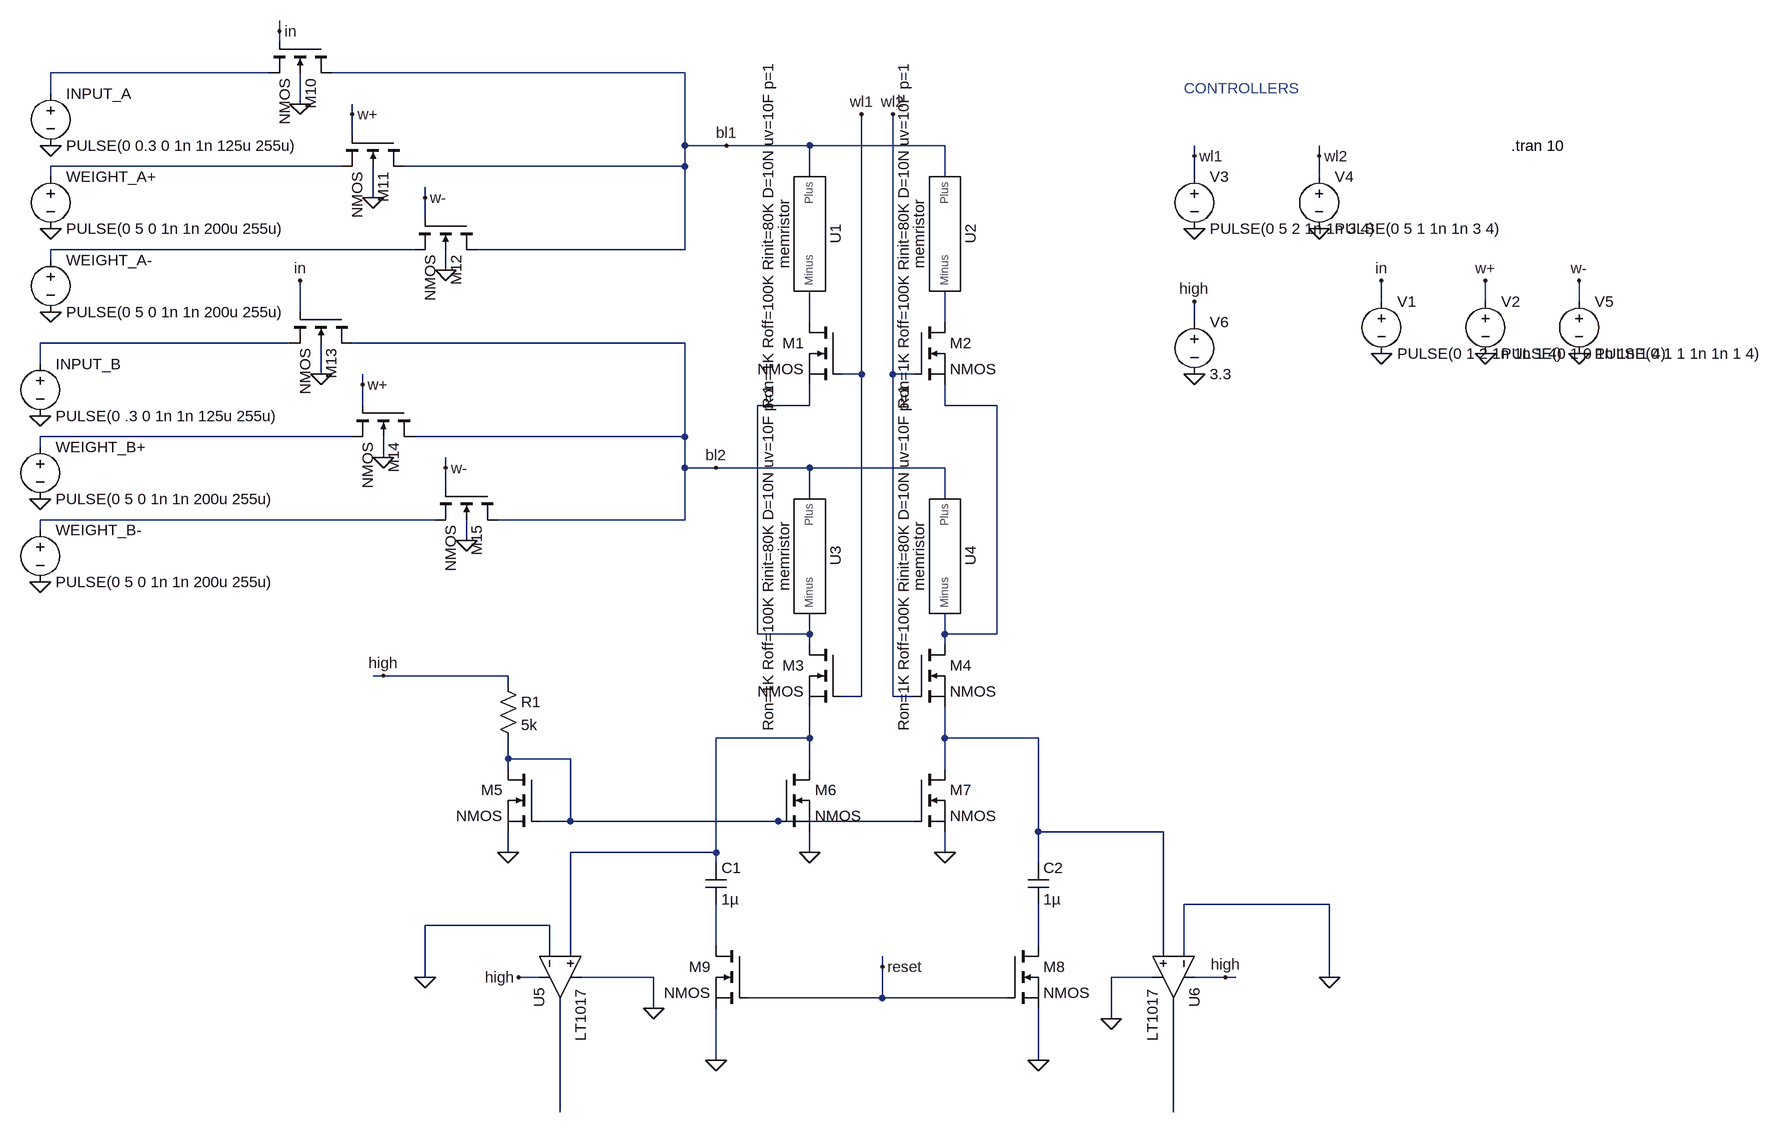
[diagram p0: schematic test_mem.asc]
test_mem.asc, the LTspice schematic file:
Version 4
SHEET 1 1712 1668
WIRE -576 0 -576 -16
WIRE -576 16 -576 0
WIRE -592 64 -928 64
WIRE 48 64 -496 64
WIRE -928 96 -928 64
WIRE -544 112 -544 64
WIRE -464 128 -464 112
WIRE -464 160 -464 128
WIRE 48 176 48 64
WIRE 112 176 48 176
WIRE 240 176 112 176
WIRE 448 176 240 176
WIRE 832 192 832 176
WIRE 1024 192 1024 176
WIRE -480 208 -928 208
WIRE 48 208 48 176
WIRE 48 208 -384 208
WIRE -928 224 -928 208
WIRE 240 224 240 176
WIRE 448 224 448 176
WIRE 832 224 832 192
WIRE 1024 224 1024 192
WIRE -432 256 -432 208
WIRE -352 256 -352 240
WIRE -352 288 -352 256
WIRE -368 336 -928 336
WIRE 48 336 48 208
WIRE 48 336 -272 336
WIRE -928 352 -928 336
WIRE -320 368 -320 336
WIRE 1120 416 1120 384
WIRE 1280 416 1280 384
WIRE 1424 416 1424 384
WIRE -544 432 -544 384
WIRE 240 448 240 400
WIRE 448 448 448 400
WIRE 832 448 832 416
WIRE -560 480 -944 480
WIRE 48 480 -464 480
WIRE -944 512 -944 480
WIRE -512 528 -512 480
WIRE 320 528 320 128
WIRE 320 528 288 528
WIRE 368 528 368 128
WIRE 400 528 368 528
WIRE -448 544 -448 528
WIRE -448 576 -448 544
WIRE 240 576 240 544
WIRE 240 576 160 576
WIRE 448 576 448 544
WIRE 528 576 448 576
WIRE -464 624 -944 624
WIRE 48 624 48 480
WIRE 48 624 -368 624
WIRE -944 640 -944 624
WIRE -416 656 -416 624
WIRE -320 672 -320 656
WIRE 48 672 48 624
WIRE 96 672 48 672
WIRE 240 672 96 672
WIRE 448 672 240 672
WIRE -320 704 -320 672
WIRE 240 720 240 672
WIRE 448 720 448 672
WIRE -336 752 -944 752
WIRE 48 752 48 672
WIRE 48 752 -240 752
WIRE -944 768 -944 752
WIRE -288 784 -288 752
WIRE 160 928 160 576
WIRE 240 928 240 896
WIRE 240 928 160 928
WIRE 448 928 448 896
WIRE 528 928 528 576
WIRE 528 928 448 928
WIRE 240 944 240 928
WIRE 448 944 448 928
WIRE -416 992 -432 992
WIRE -224 992 -416 992
WIRE -224 1008 -224 992
WIRE 320 1024 320 528
WIRE 320 1024 288 1024
WIRE 368 1024 368 528
WIRE 400 1024 368 1024
WIRE 240 1088 240 1040
WIRE 240 1088 96 1088
WIRE 448 1088 448 1040
WIRE 592 1088 448 1088
WIRE -224 1120 -224 1088
WIRE -128 1120 -224 1120
WIRE -224 1136 -224 1120
WIRE 240 1136 240 1088
WIRE 448 1136 448 1088
WIRE -128 1216 -128 1120
WIRE -128 1216 -176 1216
WIRE 192 1216 -128 1216
WIRE 400 1216 192 1216
WIRE 592 1232 592 1088
WIRE 784 1232 592 1232
WIRE -224 1264 -224 1232
WIRE 96 1264 96 1088
WIRE 96 1264 -128 1264
WIRE 240 1264 240 1232
WIRE 448 1264 448 1232
WIRE 96 1280 96 1264
WIRE 592 1280 592 1232
WIRE 1040 1344 816 1344
WIRE -160 1376 -352 1376
WIRE 96 1408 96 1344
WIRE 592 1408 592 1344
WIRE -160 1424 -160 1376
WIRE -128 1424 -128 1264
WIRE 784 1424 784 1232
WIRE 816 1424 816 1344
WIRE 352 1440 352 1424
WIRE -352 1456 -352 1376
WIRE -176 1456 -208 1456
WIRE 0 1456 -112 1456
WIRE 768 1456 704 1456
WIRE 880 1456 832 1456
WIRE 896 1456 880 1456
WIRE 1040 1456 1040 1344
WIRE 352 1488 352 1440
WIRE 352 1488 144 1488
WIRE 544 1488 352 1488
WIRE 0 1504 0 1456
WIRE 704 1520 704 1456
WIRE 96 1584 96 1504
WIRE 592 1584 592 1504
WIRE -144 1664 -144 1488
WIRE 800 1664 800 1488
FLAG 832 304 0
FLAG -928 176 0
FLAG -944 592 0
FLAG 832 192 wl1
FLAG 1024 304 0
FLAG 1024 192 wl2
FLAG 320 128 wl1
FLAG 368 128 wl2
FLAG 240 1264 0
FLAG -224 1264 0
FLAG 448 1264 0
FLAG 592 1584 0
FLAG 96 1584 0
FLAG 0 1504 0
FLAG 704 1520 0
FLAG 832 528 0
FLAG 832 416 high
FLAG 880 1456 high
FLAG -208 1456 high
FLAG -352 1456 0
FLAG 1040 1456 0
FLAG -416 992 high
FLAG -928 304 0
FLAG -928 432 0
FLAG -944 720 0
FLAG -944 848 0
FLAG 112 176 bl1
FLAG 1120 496 0
FLAG 1280 496 0
FLAG 1424 496 0
FLAG 1120 384 in
FLAG 1424 384 w-
FLAG 1280 384 w+
FLAG -576 0 in
FLAG -544 384 in
FLAG -464 128 w+
FLAG -352 256 w-
FLAG -448 544 w+
FLAG -320 672 w-
FLAG 352 1440 reset
FLAG -544 112 0
FLAG -432 256 0
FLAG -320 368 0
FLAG -512 528 0
FLAG -416 656 0
FLAG -288 784 0
FLAG 96 672 bl2
SYMBOL nmos 288 448 M0
SYMATTR InstName M1
SYMBOL nmos 400 448 R0
SYMATTR InstName M2
SYMBOL nmos 288 944 M0
SYMATTR InstName M3
SYMBOL nmos 400 944 R0
SYMATTR InstName M4
SYMBOL Voltage -928 80 R0
SYMATTR InstName INPUT_A
SYMATTR Value PULSE(0 0.3 0 1n 1n 125u 255u)
SYMBOL Voltage -944 496 R0
SYMATTR InstName INPUT_B
SYMATTR Value PULSE(0 .3 0 1n 1n 125u 255u)
SYMBOL Voltage 832 208 R0
SYMATTR InstName V3
SYMATTR Value PULSE(0 5 2 1n 1n 3 4)
SYMBOL Voltage 1024 208 R0
SYMATTR InstName V4
SYMATTR Value PULSE(0 5 1 1n 1n 3 4)
SYMBOL nmos -176 1136 M0
SYMATTR InstName M5
SYMBOL nmos 192 1136 R0
SYMATTR InstName M6
SYMBOL nmos 400 1136 R0
SYMATTR InstName M7
SYMBOL Res -240 992 R0
SYMATTR InstName R1
SYMATTR Value 5k
SYMBOL Cap 80 1280 R0
SYMATTR InstName C1
SYMATTR Value 1µ
SYMBOL Cap 576 1280 R0
SYMATTR InstName C2
SYMATTR Value 1µ
SYMBOL nmos 544 1408 R0
SYMATTR InstName M8
SYMBOL nmos 144 1408 M0
SYMATTR InstName M9
SYMBOL LT1017 -144 1456 M90
SYMATTR InstName U5
SYMBOL LT1017 800 1456 R90
SYMATTR InstName U6
SYMBOL Voltage 832 432 R0
SYMATTR InstName V6
SYMATTR Value 3.3
SYMBOL AutoGenerated/memristor 240 304 R90
SYMATTR InstName U1
SYMBOL AutoGenerated/memristor 448 304 R90
SYMATTR InstName U2
SYMBOL AutoGenerated/memristor 240 800 R90
SYMATTR InstName U3
SYMBOL AutoGenerated/memristor 448 800 R90
SYMATTR InstName U4
SYMBOL Voltage -928 208 R0
SYMATTR InstName WEIGHT_A+
SYMATTR Value PULSE(0 5 0 1n 1n 200u 255u)
SYMBOL Voltage -928 336 R0
SYMATTR InstName WEIGHT_A-
SYMATTR Value PULSE(0 5 0 1n 1n 200u 255u)
SYMBOL Voltage -944 624 R0
SYMATTR InstName WEIGHT_B+
SYMATTR Value PULSE(0 5 0 1n 1n 200u 255u)
SYMBOL Voltage -944 752 R0
SYMATTR InstName WEIGHT_B-
SYMATTR Value PULSE(0 5 0 1n 1n 200u 255u)
SYMBOL Voltage 1120 400 R0
SYMATTR InstName V1
SYMATTR Value PULSE(0 1 2 1n 1n 1 4)
SYMBOL Voltage 1280 400 R0
SYMATTR InstName V2
SYMATTR Value PULSE(0 1 0 1n 1n 1 4)
SYMBOL Voltage 1424 400 R0
SYMATTR InstName V5
SYMATTR Value PULSE(0 1 1 1n 1n 1 4)
SYMBOL nmos4 -496 16 R90
SYMATTR InstName M10
SYMBOL nmos4 -384 160 R90
SYMATTR InstName M11
SYMBOL nmos4 -272 288 R90
SYMATTR InstName M12
SYMBOL nmos4 -464 432 R90
SYMATTR InstName M13
SYMBOL nmos4 -368 576 R90
SYMATTR InstName M14
SYMBOL nmos4 -240 704 R90
SYMATTR InstName M15
TEXT 1320 176 Left 2 !.tran 10
TEXT 816 88 Left 2 ;CONTROLLERS

The netlist it stands for:
* test_mem.asc
M1 N004 wl1 N007 N007 NMOS
M2 N005 wl2 N008 N008 NMOS
M3 N007 wl1 N011 N011 NMOS
M4 N008 wl2 N012 N012 NMOS
V§INPUT_A N001 0 PULSE(0 0.3 0 1n 1n 125u 255u)
V§INPUT_B N006 0 PULSE(0 .3 0 1n 1n 125u 255u)
V3 wl1 0 PULSE(0 5 2 1n 1n 3 4)
V4 wl2 0 PULSE(0 5 1 1n 1n 3 4)
M5 N013 N013 0 0 NMOS
M6 N011 N013 0 0 NMOS
M7 N012 N013 0 0 NMOS
R1 high N013 5k
C1 N011 N014 1µ
C2 N012 N015 1µ
M8 N015 reset 0 0 NMOS
M9 N014 reset 0 0 NMOS
XU5 N011 0 high 0 N016 LT1017  ; pins In+ In- V+ V- OUT
XU6 N012 0 high 0 N017 LT1017  ; pins In+ In- V+ V- OUT
V6 high 0 3.3
XU1 bl1 N004 memristor Ron=1K Roff=100K Rinit=80K D=10N uv=10F p=1  ; pins Plus Minus
XU2 bl1 N005 memristor Ron=1K Roff=100K Rinit=80K D=10N uv=10F p=1  ; pins Plus Minus
XU3 bl2 N007 memristor Ron=1K Roff=100K Rinit=80K D=10N uv=10F p=1  ; pins Plus Minus
XU4 bl2 N008 memristor Ron=1K Roff=100K Rinit=80K D=10N uv=10F p=1  ; pins Plus Minus
V§WEIGHT_A+ N002 0 PULSE(0 5 0 1n 1n 200u 255u)
V§WEIGHT_A- N003 0 PULSE(0 5 0 1n 1n 200u 255u)
V§WEIGHT_B+ N009 0 PULSE(0 5 0 1n 1n 200u 255u)
V§WEIGHT_B- N010 0 PULSE(0 5 0 1n 1n 200u 255u)
V1 in 0 PULSE(0 1 2 1n 1n 1 4)
V2 w+ 0 PULSE(0 1 0 1n 1n 1 4)
V5 w- 0 PULSE(0 1 1 1n 1n 1 4)
M10 bl1 in N001 0 NMOS
M11 bl1 w+ N002 0 NMOS
M12 bl1 w- N003 0 NMOS
M13 bl2 in N006 0 NMOS
M14 bl2 w+ N009 0 NMOS
M15 bl2 w- N010 0 NMOS
.model NMOS NMOS
.model PMOS PMOS
.lib standard.mos
.tran 10
* CONTROLLERS
.lib D:\Chip Design Studio IIITB\Memristor\memristor.lib.cir
.backanno
.end